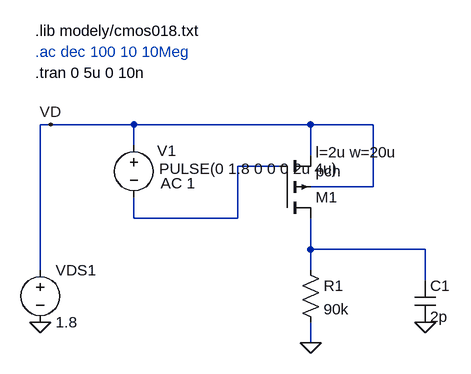
[diagram p0: schematic ses-odpor-SR.asc]
ses-odpor-SR.asc, the LTspice schematic file:
Version 4
SHEET 1 880 680
WIRE -16 48 -32 48
WIRE 112 48 -16 48
WIRE 384 48 112 48
WIRE 480 48 384 48
WIRE 112 80 112 48
WIRE 384 96 384 48
WIRE 336 112 272 112
WIRE 480 144 480 48
WIRE 480 144 384 144
WIRE 112 192 112 160
WIRE 272 192 272 112
WIRE 272 192 112 192
WIRE 384 240 384 192
WIRE 560 240 384 240
WIRE -32 272 -32 48
WIRE 384 272 384 240
WIRE 560 288 560 240
WIRE 384 384 384 352
FLAG 384 384 0
FLAG -32 352 0
FLAG -16 48 VD
FLAG 560 352 0
SYMBOL voltage -32 256 R0
WINDOW 123 0 0 Left 0
WINDOW 39 0 0 Left 0
SYMATTR InstName VDS1
SYMATTR Value 1.8
SYMBOL pmos4 336 192 M180
WINDOW 123 56 101 Left 2
SYMATTR Value2 l=2u w=20u
SYMATTR InstName M1
SYMATTR Value pch
SYMBOL res 368 256 R0
SYMATTR InstName R1
SYMATTR Value 90k
SYMBOL voltage 112 64 R0
WINDOW 0 36 24 Left 2
WINDOW 3 39 52 Left 2
WINDOW 123 41 74 Left 2
WINDOW 39 0 0 Left 0
SYMATTR InstName V1
SYMATTR Value PULSE(0 1.8 0 0 0 2u 4u)
SYMATTR Value2 AC 1
SYMBOL cap 544 288 R0
SYMATTR InstName C1
SYMATTR Value 2p
TEXT -40 -96 Left 2 !.lib modely/cmos018.txt
TEXT -40 -64 Left 2 ;.ac dec 100 10 10Meg
TEXT -40 -32 Left 2 !.tran 0 5u 0 10n

The netlist it stands for:
* ses-odpor-SR.asc
VDS1 VD 0 1.8
M1 N002 N001 VD VD pch l=2u w=20u
R1 N002 0 90k
V1 VD N001 PULSE(0 1.8 0 0 0 2u 4u) AC 1
C1 N002 0 2p
.model NMOS NMOS
.model PMOS PMOS
.lib standard.mos
.lib modely/cmos018.txt
* .ac dec 100 10 10Meg
.tran 0 5u 0 10n
.backanno
.end